# EAGLE design interceptor (EAGLE 9.6.2)
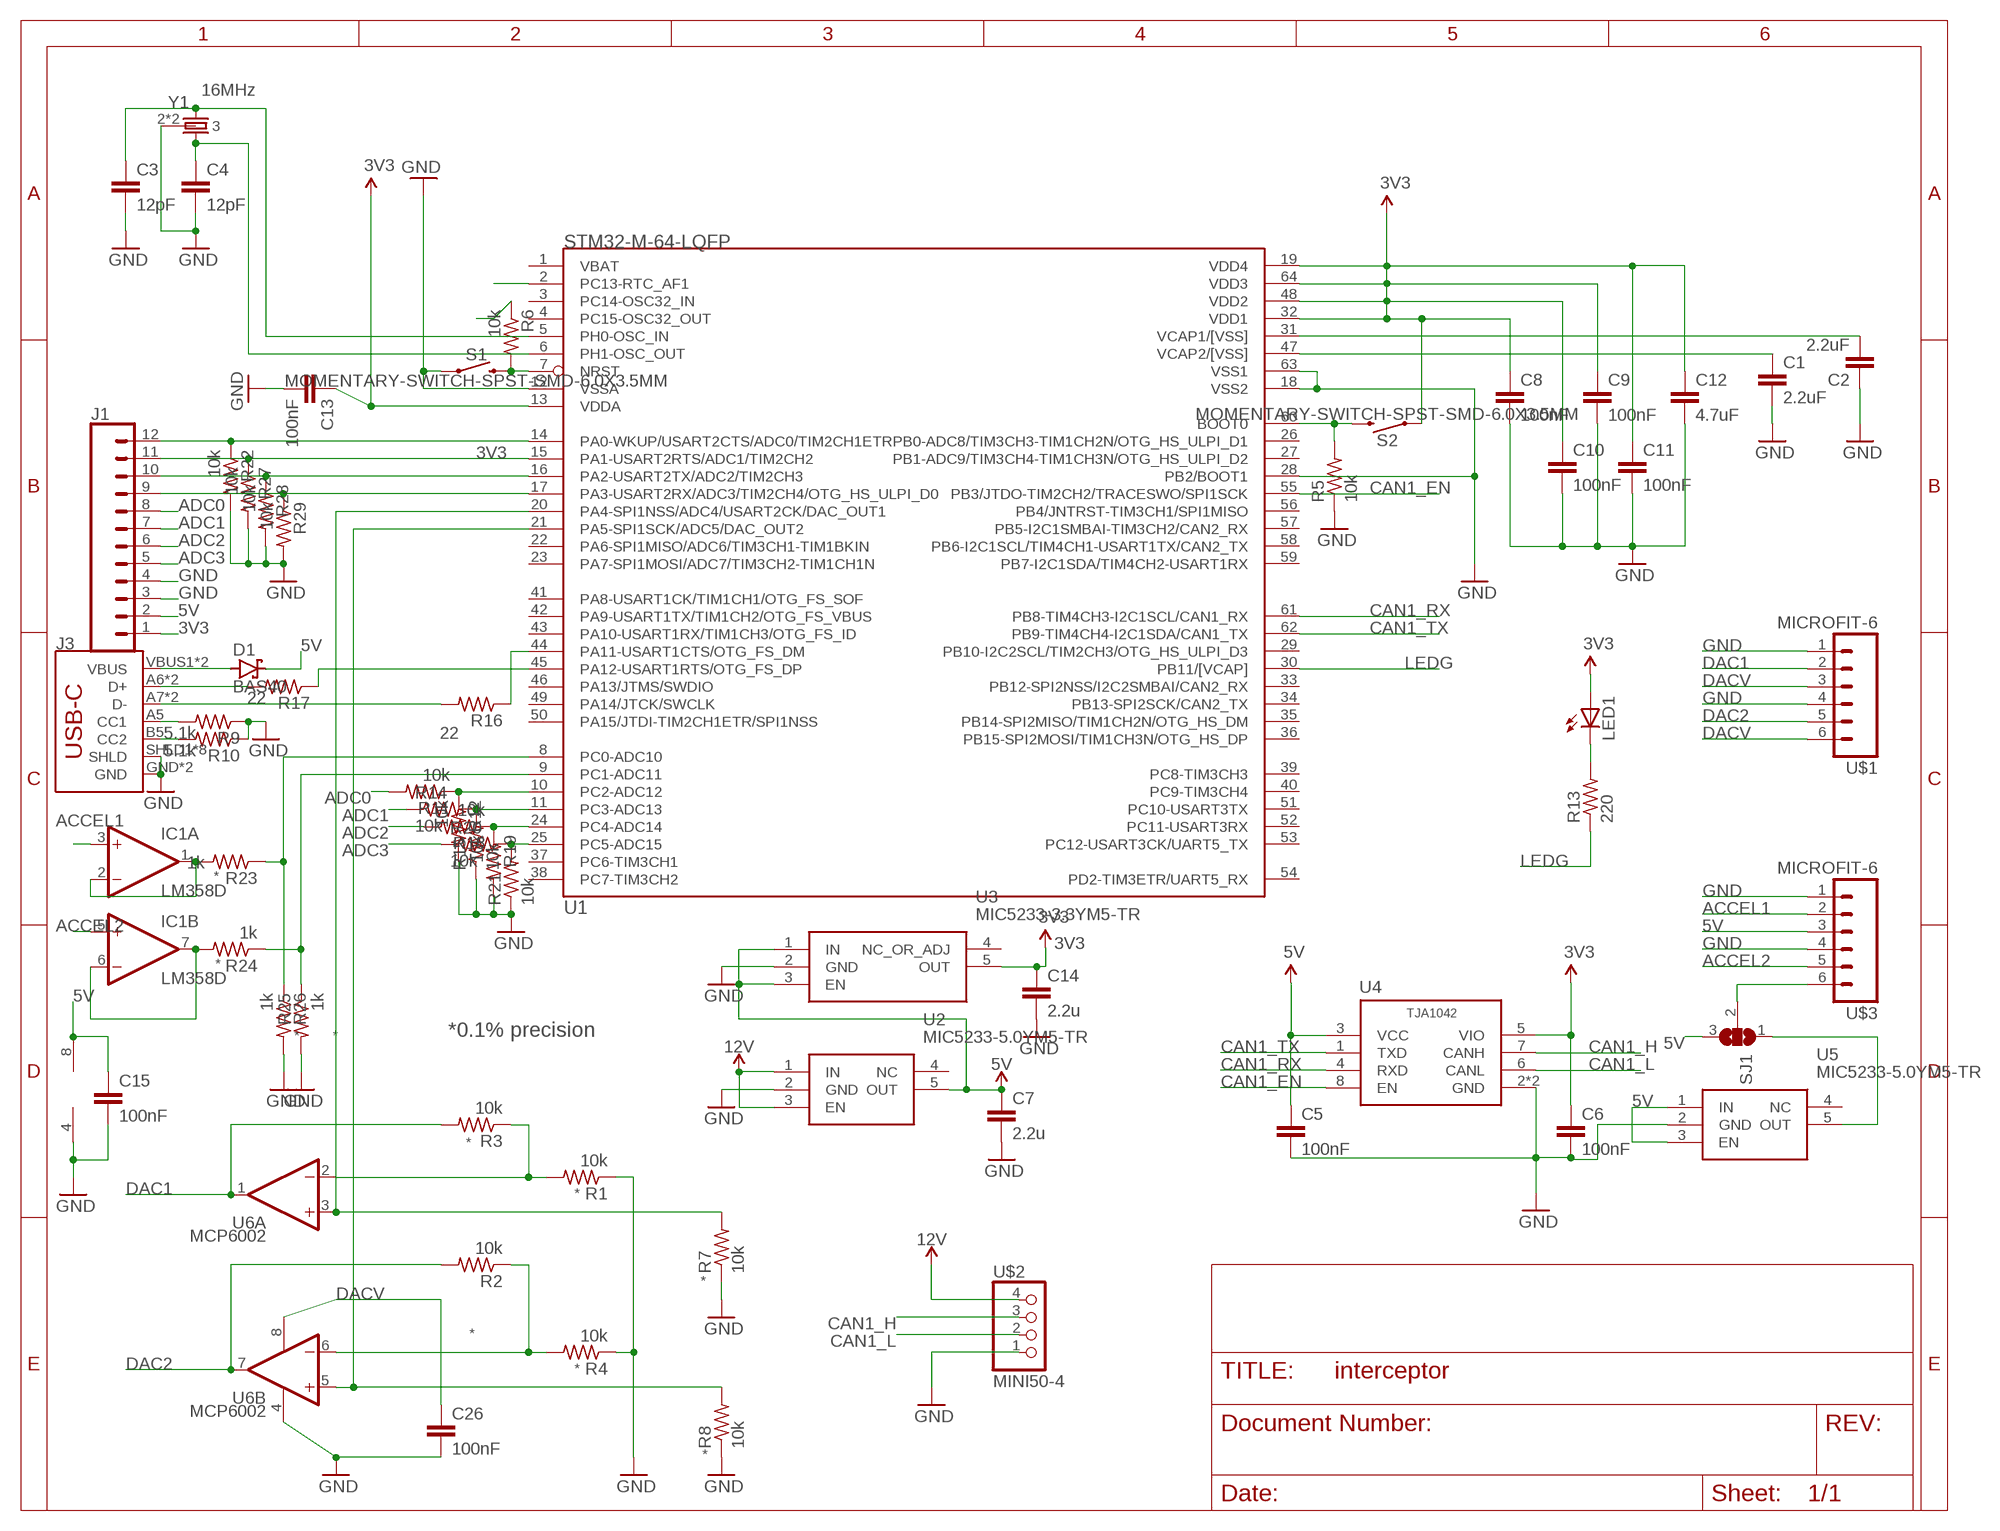
[diagram p0: schematic, sheet 1]

## Parts
C1  2.2uF  C0603  [0603-C]
C2  2.2uF  C0603  [0603-C]
C3  12pF  C0603  [0603-C]
C4  12pF  C0603  [0603-C]
C5  100nF  C0603  [0603-C]
C6  100nF  C0603  [0603-C]
C7  2.2u  C-EUC0603  [C0603]
C8  100nF  C0603  [0603-C]
C9  100nF  C0603  [0603-C]
C10  100nF  C0603  [0603-C]
C11  100nF  C0603  [0603-C]
C12  4.7uF  C0603  [0603-C]
C13  100nF  C0603  [0603-C]
C14  2.2u  C-EUC0603  [C0603]
C15  100nF  C0603  [0603-C]
C26  100nF  C0603  [0603-C]
D1  BAS40  [SOT23]
IC1  LM358D  [SO08]
J1  CONN_12  [1X12]
J3  USB-C-BREAKOUT_SPARKFUN-CONNECTORS_USB_C16PIN  [USB-C-BREAKOUT_SPARKFUN-CONNECTORS_USB-C-16P]
LED1  LEDCHIPLED_0805  [CHIPLED_0805]
R1  10k  R0402  [0402-R]
R2  10k  R0402  [0402-R]
R3  10k  R0402  [0402-R]
R4  10k  R0402  [0402-R]
R5  10k  R0402  [0402-R]
R6  10k  R0402  [0402-R]
R7  10k  R0402  [0402-R]
R8  10k  R0402  [0402-R]
R9  5.1k  R0402  [0402-R]
R10  5.1k  R0402  [0402-R]
R11  10k  R0402  [0402-R]
R12  10k  R0402  [0402-R]
R13  220  R0402  [0402-R]
R14  10k  R0402  [0402-R]
R15  10k  R0402  [0402-R]
R16  22  R0402  [0402-R]
R17  22  R0402  [0402-R]
R18  10k  R0402  [0402-R]
R19  10k  R0402  [0402-R]
R20  10k  R0402  [0402-R]
R21  10k  R0402  [0402-R]
R22  10k  R0402  [0402-R]
R23  1k  R0402  [0402-R]
R24  1k  R0402  [0402-R]
R25  1k  R0402  [0402-R]
R26  1k  R0402  [0402-R]
R27  10k  R0402  [0402-R]
R28  10k  R0402  [0402-R]
R29  10k  R0402  [0402-R]
S1  MOMENTARY-SWITCH-SPST-SMD-6.0X3.5MM  [TACTILE_SWITCH_SMD_6.0X3.5MM]
S2  MOMENTARY-SWITCH-SPST-SMD-6.0X3.5MM  [TACTILE_SWITCH_SMD_6.0X3.5MM]
SJ1  SJ2W  [SJ_2]
U1  STM32-M-64-LQFP  [LQFP64]
U2  MIC5233-5.0YM5-TR  [SOT95P280X145-5N]
U3  MIC5233-3.3YM5-TR  [SOT95P280X145-5N]
U4  TJA1042HVSON  [HVSON8]
U5  MIC5233-5.0YM5-TR  [SOT95P280X145-5N]
U6  MCP6002  LM358D  [SO08]
U$1  MICROFIT-6  [MICROFIT-6]
U$2  MINI50-4  [MINI50]
U$3  MICROFIT-6  [MICROFIT-6]
Y1  16MHz  CRYSTAL-3.2X2.54-PIN  [XTAL-3.2X2.5]

## Nets
3V3: C6.1 C8.1 C9.1 C10.1 C11.1 C12.1 C13.1 C14.1 J1.1 LED1.A R6.1 S2.1 U1.13(VDDA) U1.19(VDD4) U1.32(VDD1) U1.48(VDD2) U1.64(VDD3) U3.5(OUT) U4.5(VIO)
5V: C5.1 C7.1 C15.1 D1.3(C) IC1.8(P:V+) J1.2 SJ1.3 U2.5(OUT) U3.1(IN) U3.3(EN) U4.3(VCC) U5.1(IN) U5.3(EN) U$3.3
12V: U2.1(IN) U2.3(EN) U$2.4
ACCEL1: IC1.3(A:+IN) U$3.2
ACCEL2: IC1.5(B:+IN) U$3.5
ADC0: J1.8 R11.2
ADC1: J1.7 R14.1
ADC2: J1.6 R18.2
ADC3: J1.5 R20.1
CAN1_EN: U1.55(PB3/JTDO-TIM2CH2/TRACESWO/SPI1SCK) U4.8(EN)
CAN1_H: U4.7(CANH) U$2.3
CAN1_L: U4.6(CANL) U$2.2
CAN1_RX: U1.61(PB8-TIM4CH3-I2C1SCL/CAN1_RX) U4.4(RXD)
CAN1_TX: U1.62(PB9-TIM4CH4-I2C1SDA/CAN1_TX) U4.1(TXD)
DAC1: R3.2 U6.1(A:OUT) U$1.2
DAC2: R2.2 U6.7(B:OUT) U$1.5
DACV: C26.1 U6.8(P:V+) U$1.3 U$1.6
GND: C1.2 C2.1 C3.2 C4.2 C5.2 C6.2 C7.2 C8.2 C9.2 C10.2 C11.2 C12.2 C13.2 C14.2 C15.2 C26.2 IC1.4(P:V-) J1.3 J1.4 J3.GND J3.GND2(GND) J3.SHLD1(SHLD) J3.SHLD2(SHLD) J3.SHLD3(SHLD) J3.SHLD4(SHLD) J3.SHLD5(SHLD) J3.SHLD6(SHLD) J3.SHLD7(SHLD) J3.SHLD8(SHLD) R1.1 R4.1 R5.1 R7.1 R8.1 R9.1 R10.1 R12.2 R15.1 R19.2 R21.1 R22.2 R25.2 R26.2 R27.2 R28.2 R29.2 S1.1 U1.12(VSSA) U1.18(VSS2) U1.28(PB2/BOOT1) U1.63(VSS1) U2.2(GND) U3.2(GND) U4.2(GND) U4.PAD(GND) U5.2(GND) U6.4(P:V-) U$1.1 U$1.4 U$2.1 U$3.1 U$3.4 Y1.2 Y1.4
LEDG: R13.1 U1.30(PB11/[VCAP])
N$1: C3.1 U1.5(PH0-OSC_IN) Y1.1
N$2: R16.1 U1.44(PA11-USART1CTS/OTG_FS_DM)
N$3: C4.1 U1.6(PH1-OSC_OUT) Y1.3
N$4: R17.1 U1.45(PA12-USART1RTS/OTG_FS_DP)
N$5: J3.A7(D-) J3.B7(D-) R16.2
N$6: J3.A6(D+) J3.B6(D+) R17.2
N$7: R5.2 S2.2 U1.60(BOOT0)
N$8: J3.A5(CC1) R9.2
N$9: J3.B5(CC2) R10.2
N$10: R6.2 S1.2 U1.7(NRST)
N$11: D1.1(A) J3.VBUS1(VBUS) J3.VBUS2(VBUS)
N$12: SJ1.2 U$3.6
N$13: IC1.1(A:OUT) IC1.2(A:-IN) R23.2
N$14: SJ1.1 U5.5(OUT)
N$15: IC1.6(B:-IN) IC1.7(B:OUT) R24.2
N$16: R11.1 R12.1 U1.10(PC2-ADC12)
N$17: R7.2 U1.20(PA4-SPI1NSS/ADC4/USART2CK/DAC_OUT1) U6.3(A:+IN)
N$18: R8.2 U1.21(PA5-SPI1SCK/ADC5/DAC_OUT2) U6.5(B:+IN)
N$19: R14.2 R15.2 U1.11(PC3-ADC13)
N$20: R18.1 R19.1 U1.24(PC4-ADC14)
N$21: R1.2 R3.1 U6.2(A:-IN)
N$22: R2.1 R4.2 U6.6(B:-IN)
N$23: R20.2 R21.2 U1.25(PC5-ADC15)
N$24: U1.2(PC13-RTC_AF1)
N$26: LED1.C R13.2
N$29: J1.9 R29.1 U1.17(PA3-USART2RX/ADC3/TIM2CH4/OTG_HS_ULPI_D0)
N$30: J1.10 R28.1 U1.16(PA2-USART2TX/ADC2/TIM2CH3)
N$31: J1.11 R27.1 U1.15(PA1-USART2RTS/ADC1/TIM2CH2)
N$32: J1.12 R22.1 U1.14(PA0-WKUP/USART2CTS/ADC0/TIM2CH1ETR)
N$41: R23.1 R26.1 U1.8(PC0-ADC10)
N$42: R24.1 R25.1 U1.9(PC1-ADC11)
VCAP1: C2.2 U1.31(VCAP1/[VSS])
VCAP2: C1.1 U1.47(VCAP2/[VSS])
Unconnected: U1.1(VBAT) U1.3(PC14-OSC32_IN) U1.4(PC15-OSC32_OUT) U1.22(PA6-SPI1MISO/ADC6/TIM3CH1-TIM1BKIN) U1.23(PA7-SPI1MOSI/ADC7/TIM3CH2-TIM1CH1N) U1.26(PB0-ADC8/TIM3CH3-TIM1CH2N/OTG_HS_ULPI_D1) U1.27(PB1-ADC9/TIM3CH4-TIM1CH3N/OTG_HS_ULPI_D2) U1.29(PB10-I2C2SCL/TIM2CH3/OTG_HS_ULPI_D3) U1.33(PB12-SPI2NSS/I2C2SMBAI/CAN2_RX) U1.34(PB13-SPI2SCK/CAN2_TX) U1.35(PB14-SPI2MISO/TIM1CH2N/OTG_HS_DM) U1.36(PB15-SPI2MOSI/TIM1CH3N/OTG_HS_DP) U1.37(PC6-TIM3CH1) U1.38(PC7-TIM3CH2) U1.39(PC8-TIM3CH3) U1.40(PC9-TIM3CH4) U1.41(PA8-USART1CK/TIM1CH1/OTG_FS_SOF) U1.42(PA9-USART1TX/TIM1CH2/OTG_FS_VBUS) U1.43(PA10-USART1RX/TIM1CH3/OTG_FS_ID) U1.46(PA13/JTMS/SWDIO) U1.49(PA14/JTCK/SWCLK) U1.50(PA15/JTDI-TIM2CH1ETR/SPI1NSS) U1.51(PC10-USART3TX) U1.52(PC11-USART3RX) U1.53(PC12-USART3CK/UART5_TX) U1.54(PD2-TIM3ETR/UART5_RX) U1.56(PB4/JNTRST-TIM3CH1/SPI1MISO) U1.57(PB5-I2C1SMBAI-TIM3CH2/CAN2_RX) U1.58(PB6-I2C1SCL/TIM4CH1-USART1TX/CAN2_TX) U1.59(PB7-I2C1SDA/TIM4CH2-USART1RX) U2.4(NC) U3.4(NC_OR_ADJ) U5.4(NC)

## Notes on the sheet
- *
- *
- * | * | *0.1% precision
- *
- *
- *
- *
- *
- *

## Library data of the parts
C1-C6 C8-C13 C15 C26 = comma.ai:C
C7 C14 = rcl:C-EU: CAPACITOR, European symbol; SPICEPREFIX: C
D1 = diode:BAS40: Silicon Schottky Diodes General-purpose diode for high-speed switching
IC1 U6 = comma.ai:LM358: OP AMP also LM158; LM258; LM2904 Source: http://cache.national.com/ds/LM/LM158.pdf
J1 = SparkFun-Connectors:CONN_12: Multi connection point. Often used as Generic Header-pin footprint for 0.1 inch spaced/style header connections On any of the 0.1 inch spaced packages, you can populate with these: Break Away Headers - Straight <https://www.sparkfun.com/products/116> (PRT-00116) Break Away Male Headers - Right Angle <https://www.sparkfun.com/products/553> (PRT-00553) Female Headers <https://www.sparkfun.com/products/115> (PRT-00115) Break Away Headers - Machine Pin <https://www.sparkfun.com/products/117> (PRT-00117) Break Away Female Headers - Swiss Machine Pin <https://www.sparkfun.com/products/743> (PRT-00743) For SCREWTERMINALS and SPRING TERMINALS visit here: Screw Terimnals on SparkFun.com <https://www.sparkfun.com/search/results?term=Screw+Terminals> (5mm/3.5mm/2.54mm spacing) This device is also useful as a general connection point to wire up your design to another part of your project. Our various solder wires solder well into these plated through hole pads. Hook-Up Wire - Assortment (Stranded, 22 AWG) <https://www.sparkfun.com/products/11375> (PRT-11375) Hook-Up Wire - Assortment (Solid Core, 22 AWG) <https://www.sparkfun.com/products/11367> (PRT-11367) View the entire wire category on our website here <https://www.sparkfun.com/categories/141> Special notes: Molex polarized connector foot print use with SKU : PRT-08231 with associated crimp pins and housings. 1MM SMD Version SKU: PRT-10208 NOTES ON THE VARIANTS LOCK and LOCK_LONGPADS... This footprint was designed to help hold the alignment of a through-hole component (i.e. 6-pin header) while soldering it into place. You may notice that each hole has been shifted either up or down by 0.005 of an inch from it's more standard position (which is a perfectly straight line). This slight alteration caused the pins (the squares in the middle) to touch the edges of the holes. Because they are alternating, it causes a "brace" to hold the component in place. 0.005 has proven to be the perfect amount of "off-center" position when using our standard breakaway headers. Although looks a little odd when you look at the bare footprint, once you have a header in there, the alteration is very hard to notice. Also,if you push a header all the way into place, it is covered up entirely on the bottom side.
J3 = ROTR-Wireless:USB-C-BREAKOUT_SPARKFUN-CONNECTORS_USB_C: USB Type C 16Pin Connector Super Speed pins not available on the 16-pin purely SMD connector so this part is best for USB 2.0 implementations. D1 and D2 are tied together enabling D+/- no matter which way the cable is plugged into the connector. The two channel configuration pins (CC1/2) are exposed. These are normally connected to ground via 5.1k resistors but can be reconfigured for high current/high power applications.; PROD_ID: CONN-14122
LED1 = adafruit:LED: LED OSRAM: - CHIPLED LG R971, LG N971, LY N971, LG Q971, LY Q971, LO R971, LY R971 LH N974, LH R974 LS Q976, LO Q976, LY Q976 LO Q996 - Hyper CHIPLED LW Q18S LB Q993, LB Q99A, LB R99A - SideLED LS A670, LO A670, LY A670, LG A670, LP A670 LB A673, LV A673, LT A673, LW A673 LH A674 LY A675 LS A676, LA A676, LO A676, LY A676, LW A676 LS A679, LY A679, LG A679 - Hyper Micro SIDELED® LS Y876, LA Y876, LO Y876, LY Y876 LT Y87S - SmartLED LW L88C, LW L88S LB L89C, LB L89S, LG L890 LS L89K, LO L89K, LY L89K LS L896, LA L896, LO L896, LY L896 - TOPLED LS T670, LO T670, LY T670, LG T670, LP T670 LSG T670, LSP T670, LSY T670, LOP T670, LYG T670 LG T671, LOG T671, LSG T671 LB T673, LV T673, LT T673, LW T673 LH T674 LS T676, LA T676, LO T676, LY T676, LB T676, LH T676, LSB T676, LW T676 LB T67C, LV T67C, LT T67C, LS T67K, LO T67K, LY T67K, LW E67C LS E67B, LA E67B, LO E67B, LY E67B, LB E67C, LV E67C, LT E67C LW T67C LS T679, LY T679, LG T679 LS T770, LO T770, LY T770, LG T770, LP T770 LB T773, LV T773, LT T773, LW T773 LH T774 LS E675, LA E675, LY E675, LS T675 LS T776, LA T776, LO T776, LY T776, LB T776 LHGB T686 LT T68C, LB T68C - Hyper Mini TOPLED® LB M676 - Mini TOPLED Santana® LG M470 LS M47K, LO M47K, LY M47K Source: http://www.osram.convergy.de/
R1-R29 = comma.ai:R
S1 S2 = SparkFun-Switches:MOMENTARY-SWITCH-SPST: Momentary Switch (Pushbutton) - SPST Normally-open (NO) SPST momentary switches (buttons, pushbuttons). Variants PTH-12MM - 12mm square, through-hole Momentary Pushbutton Switch - 12mm Square <https://www.sparkfun.com/products/9190> (COM-09190) PTH-6.0MM, PTH-6.0MM-KIT - 6.0mm square, through-hole Mini Pushbutton Switch <https://www.sparkfun.com/products/97> (COM-00097) KIT package intended for soldering kit's - only one side of pads' copper is exposed. PTH-RIGHT-ANGLE-KIT - Right-angle, through-hole Right Angle Tactile Button <https://www.sparkfun.com/products/10791> - Used on SparkFun BigTime Watch Kit <https://www.sparkfun.com/products/11734> SMD-12MM - 12mm square, surface-mount Tactile Button - SMD (12mm) <https://www.sparkfun.com/products/12993> (COM-12993) Used on SparkFun PicoBoard <https://www.sparkfun.com/products/11888> SMD-4.5MM - 4.5mm Square Trackball Switch Used on SparkFun Blackberry Trackballer Breakout <https://www.sparkfun.com/products/13169> SMD-4.6MMX2.8MM - 4.60mm x 2.80mm, surface mount Used on SparkFun SAMD21 Mini Breakout <https://www.sparkfun.com/products/13664> SMD-5.2MM, SMD-5.2-REDUNDANT - 5.2mm square, surface-mount Mini Pushbutton Switch - SMD <https://www.sparkfun.com/products/8720> (COM-08720) Used on Arduino Pro Mini <https://www.sparkfun.com/products/11114> REDUNDANT package connects both switch circuits together SMD-6.0X3.5MM - 6.0 x 3.5mm, surface mount Momentary Reset Switch SMD <https://www.sparkfun.com/products/8229> (COM-08229) SMD-6.2MM-TALL - 6.2mm square, surface mount Tactile Button - SMD (6mm) <https://www.sparkfun.com/products/12992> Used on SparkFun Digital Sandbox <https://www.sparkfun.com/products/12651> SMD-RIGHT-ANGLE - Right-angle, surface mount Used on SparkFun Block for Intel® Edison - Arduino <https://www.sparkfun.com/products/13036>; PROD_ID: SWCH-00815; SF_SKU: COM-08229
SJ1 = jumper:SJ2W: SMD solder JUMPER
U1 = comma.ai:STM32-M-64-LQFP: STM32F103 Medium Density 64pin LQFP
U2 U5 = SamacSys_Parts:MIC5233-5.0YM5-TR: MICROCHIP - MIC5233-5.0YM5-TR - LDO, REG, 36VIN, 0.1A, 5V, 2%, 5SOT23 Source: Datasheet <https://componentsearchengine.com/Datasheets/2/MIC5233-5.0YM5-TR.pdf>; DESCRIPTION: MICROCHIP - MIC5233-5.0YM5-TR - LDO, REG, 36VIN, 0.1A, 5V, 2%, 5SOT23; HEIGHT: 1.45mm; MANUFACTURER_NAME: Microchip; MANUFACTURER_PART_NUMBER: MIC5233-5.0YM5-TR; MOUSER_PART_NUMBER: 998-MIC5233-5.0YM5TR; MOUSER_PRICE-STOCK: https://www.mouser.co.uk/ProductDetail/Microchip-Technology-Micrel/MIC5233-50YM5-TR?qs=U6T8BxXiZAWSnpCHgrMajw%3D%3D
U3 = SamacSys_Parts:MIC5233-3.3YM5-TR: High Input Voltage Low IQ UCAP LDO Regulator Source: Datasheet <http://ww1.microchip.com/downloads/en/DeviceDoc/MIC5233-Data-Sheet-DS20006033D.pdf>; DESCRIPTION: High Input Voltage Low IQ UCAP LDO Regulator; HEIGHT: 1.45mm; MANUFACTURER_NAME: Microchip; MANUFACTURER_PART_NUMBER: MIC5233-3.3YM5-TR; MOUSER_PART_NUMBER: 998-MIC5233-3.3YM5TR; MOUSER_PRICE-STOCK: https://www.mouser.co.uk/ProductDetail/Microchip-Technology-Micrel/MIC5233-33YM5-TR?qs=U6T8BxXiZAWDhshLMgpaLQ%3D%3D
U4 = comma.ai:TJA1042
U$1 U$3 = interceptor:MICROFIT-6
U$2 = interceptor:MINI50-4
Y1 = comma.ai:CRYSTAL-3.2X2.5

## Board
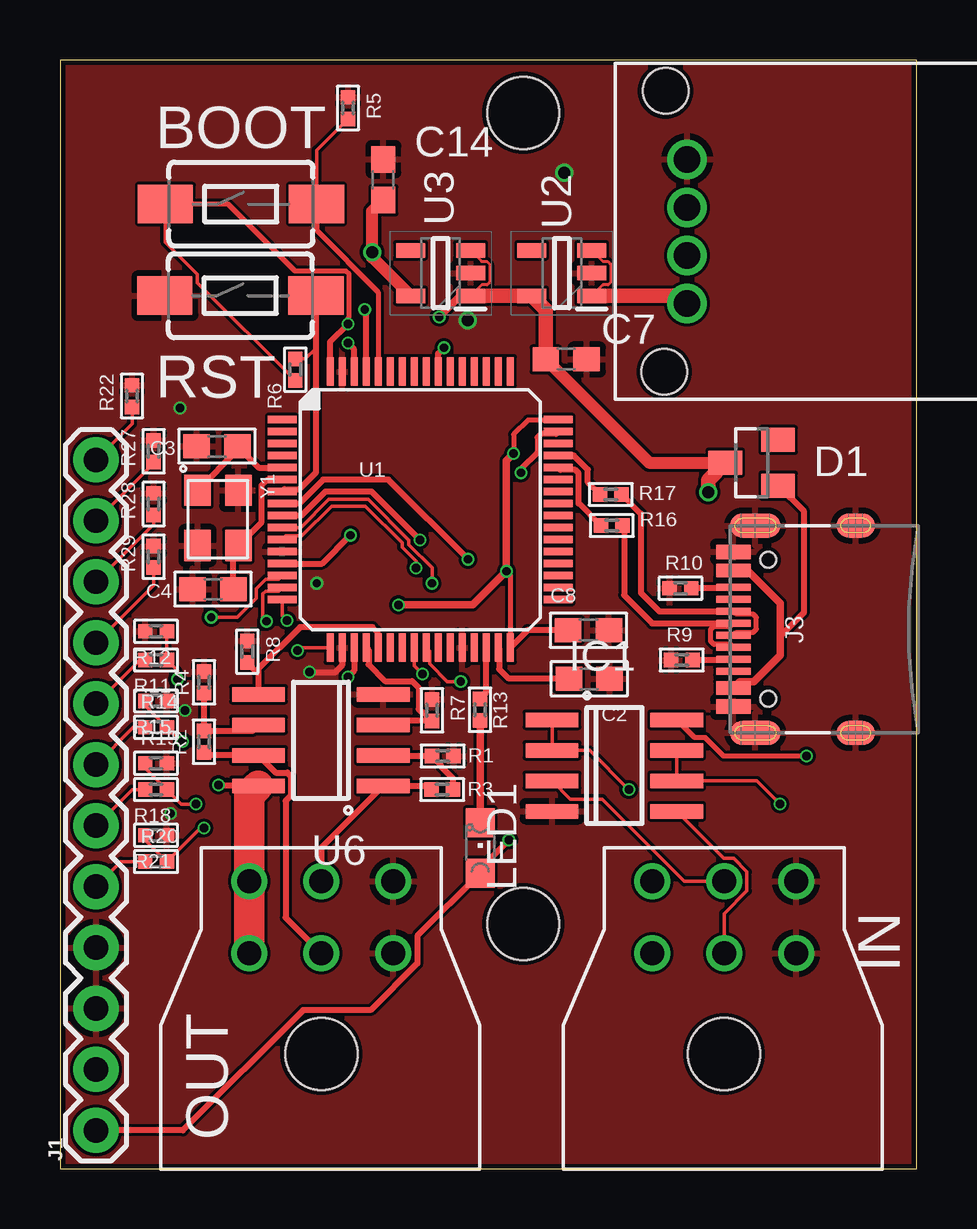
[diagram p1: board, top side]
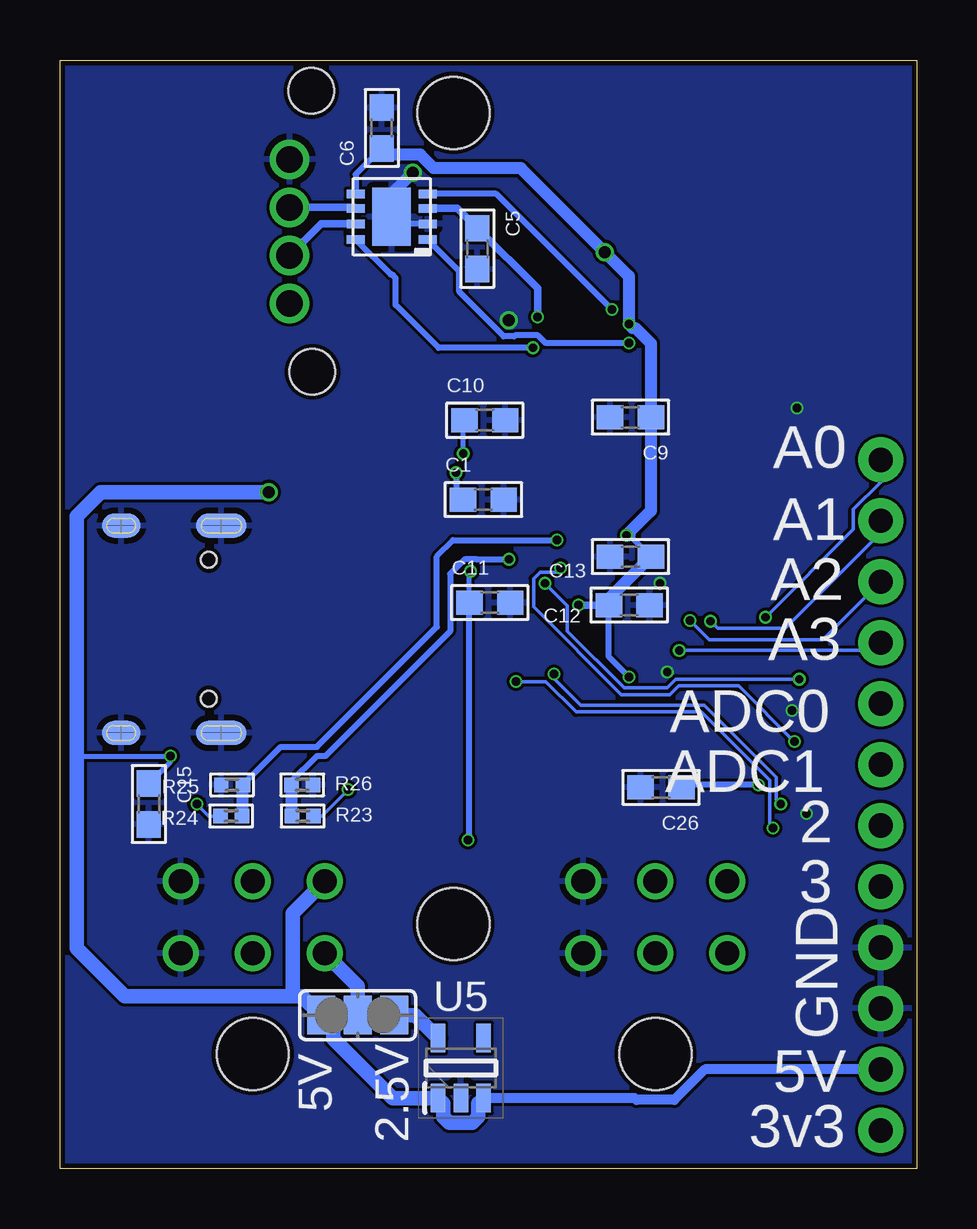
[diagram p2: board, bottom side, seen from below]

Size 35.7 x 46.2 mm. Coordinates in mm from the lower left corner, seen from the top.
Outline: 0,0 35.7,0 35.7,46.2 0,46.2 0,0
Copper layers (1*16): Top 0.035559375mm / dielectric 1.6mm / Bottom 0.035559375mm
Design rules "jlcpcb2layer": minimum track width 5mil, minimum drill 12mil, track to track 5mil, track to pad 5mil, pad to pad 5mil, via to via 5mil, smd to smd 5mil, copper to edge 8mil, drill to drill 6mil, minimum pad ring 5mil, minimum via ring 3mil, stop-mask expansion 2.5mil, vias tented up to drill 0mil, thermal gap 10mil
Holes 3 mm at 19.3,10.2 19.3,44

### Footprints (pad centres in the part's own frame; a part is rotated, then mirrored left to right if it is on the bottom)
0603-C = smd 1.1 x 1: 1 -0.85,0; 2 0.85,0
C0603 = smd 1.1 x 1: 1 -0.85,0; 2 0.85,0
SOT23 = smd 1 x 1.4: 1 -0.95,-1.1; 2 0.95,-1.1; 3 0,1.1
SO08 = smd 0.6 x 2.2: 1 -1.905,-2.6; 2 -0.635,-2.6; 3 0.635,-2.6; 4 1.905,-2.6; 5 1.905,2.6; 6 0.635,2.6; 7 -0.635,2.6; 8 -1.905,2.6
1X12 = drill 1.016 pad 1.88: 1 0,0; 2 2.54,0; 3 5.08,0; 4 7.62,0; 5 10.16,0; 6 12.7,0; 7 15.24,0; 8 17.78,0; 9 20.32,0; 10 22.86,0; 11 25.4,0; 12 27.94,0
USB-C-BREAKOUT_SPARKFUN-CONNECTORS_USB-C-16P = smd 0.3 x 1.45: A5 -1.25,0; A6 -0.25,0; A7 0.25,0; A8 1.25,0; B5 1.75,0; B6 0.75,0; B7 -0.75,0; B8 -1.75,0 | smd 0.6 x 1.45: GND -3.225,0; GND2 3.225,0 | smd 1 x 2.1: SHLD1 -4.32,-0.915; SHLD2 4.32,-0.915 | smd 1 x 2.1 bottom: SHLD3 -4.32,-0.915; SHLD4 4.32,-0.915 | smd 1 x 1.6: SHLD5 -4.32,-5.095; SHLD8 4.32,-5.095 | smd 1 x 1.6 bottom: SHLD6 -4.32,-5.095; SHLD7 4.32,-5.095 | smd 0.55 x 1.45: VBUS1 -2.45,0; VBUS2 2.45,0 | hole 0.65: -2.89,-1.445; 2.89,-1.445
CHIPLED_0805 = smd 1.2 x 1.2: A 0,-1.05; C 0,1.05
0402-R = smd 0.6 x 0.6: 1 -0.45,0; 2 0.45,0
TACTILE_SWITCH_SMD_6.0X3.5MM = smd 2.3 x 1.6: 1 -3.15,0; 2 3.15,0
SJ_2 = smd 1.168 x 1.6: 1 -1.524,0; 2 0,0; 3 1.524,0
LQFP64 = smd 1.2 x 0.3: 1 -5.75,3.75; 2 -5.75,3.25; 3 -5.75,2.75; 4 -5.75,2.25; 5 -5.75,1.75; 6 -5.75,1.25; 7 -5.75,0.75; 8 -5.75,0.25; 9 -5.75,-0.25; 10 -5.75,-0.75; 11 -5.75,-1.25; 12 -5.75,-1.75; 13 -5.75,-2.25; 14 -5.75,-2.75; 15 -5.75,-3.25; 16 -5.75,-3.75; 33 5.75,-3.75; 34 5.75,-3.25; 35 5.75,-2.75; 36 5.75,-2.25; 37 5.75,-1.75; 38 5.75,-1.25; 39 5.75,-0.75; 40 5.75,-0.25; 41 5.75,0.25; 42 5.75,0.75; 43 5.75,1.25; 44 5.75,1.75; 45 5.75,2.25; 46 5.75,2.75; 47 5.75,3.25; 48 5.75,3.75 | smd 0.3 x 1.2: 17 -3.75,-5.75; 18 -3.25,-5.75; 19 -2.75,-5.75; 20 -2.25,-5.75; 21 -1.75,-5.75; 22 -1.25,-5.75; 23 -0.75,-5.75; 24 -0.25,-5.75; 25 0.25,-5.75; 26 0.75,-5.75; 27 1.25,-5.75; 28 1.75,-5.75; 29 2.25,-5.75; 30 2.75,-5.75; 31 3.25,-5.75; 32 3.75,-5.75; 49 3.75,5.75; 50 3.25,5.75; 51 2.75,5.75; 52 2.25,5.75; 53 1.75,5.75; 54 1.25,5.75; 55 0.75,5.75; 56 0.25,5.75; 57 -0.25,5.75; 58 -0.75,5.75; 59 -1.25,5.75; 60 -1.75,5.75; 61 -2.25,5.75; 62 -2.75,5.75; 63 -3.25,5.75; 64 -3.75,5.75
SOT95P280X145-5N = smd 1.2 x 0.6: 1 -1.25,0.95; 2 -1.25,0; 3 -1.25,-0.95; 4 1.25,-0.95; 5 1.25,0.95
HVSON8 = smd 0.75 x 0.35: 1 -1.5,0.95; 2 -1.5,0.3; 3 -1.5,-0.35; 4 -1.5,-0.95; 5 1.5,-0.95; 6 1.5,-0.35; 7 1.5,0.3; 8 1.5,0.95 | smd 1.6 x 2.4: PAD 0,0
MICROFIT-6 = drill 1: 1 3,0; 2 0,0; 3 -3,0; 4 3,-3; 5 0,-3; 6 -3,-3 | hole 3: 0,-7.2
MINI50 = drill 1.1: 1 0,0; 2 2,0; 3 4,0; 4 6,0 | hole 1.9: -2.85,-0.9; 8.85,-0.95
XTAL-3.2X2.5 = smd 1.3 x 1.1: 1 0,-1.8; 2 2.3,-1.8; 3 2.3,-0.1; 4 0,-0.1

### Placement (x,y rotation side)
C1  18.06,27.88 0 bottom
C2  22.05,20.42 180 top
C3  6.54,30.11 180 top
C4  6.38,24.15 180 top
C5  18.31,38.34 270 bottom
C6  22.29,43.37 90 bottom
C7  21.09,33.73 0 top
C8  22.02,22.44 0 top
C9  11.93,31.32 180 bottom
C10  18,31.19 0 bottom
C11  17.79,23.59 0 bottom
C12  11.98,23.49 0 bottom
C13  11.93,25.51 180 bottom
C14  13.47,41.21 90 top
C15  32,15.2 270 bottom
C26  10.66,15.89 180 bottom
D1  28.82,29.42 90 top
IC1  23.1,16.8 270 top
J1  1.5,1.6 90 top
J3  28.06,22.48 90 top
LED1  17.51,13.37 0 top
R1  15.95,17.2 180 top
R2  6,17.79 270 top
R3  15.93,15.8 180 top
R4  6,20.27 270 top
R5  12,44.2 270 top
R6  9.8,33.3 90 top
R7  15.5,19.11 270 top
R8  7.8,21.55 270 top
R9  25.91,21.2 0 top
R10  25.85,24.19 0 top
R11  4,21.2 180 top
R12  4,22.4 180 top
R13  17.5,19.13 270 top
R14  4,18.4 0 top
R15  4,19.5 180 top
R16  22.99,26.8 0 top
R17  22.95,28.1 0 top
R18  4,15.8 180 top
R19  4,16.9 0 top
R20  4,12.8 0 top
R21  4,13.9 180 top
R22  3,32.2 90 top
R23  25.59,14.7 0 bottom
R24  28.57,14.7 180 bottom
R25  28.53,16 180 bottom
R26  25.61,16 0 bottom
R27  3.9,29.9 90 top
R28  3.9,27.7 90 top
R29  3.9,25.5 90 top
S1  7.52,36.38 0 top
S2  7.54,40.2 0 top
SJ1  23.3,6.4 180 bottom
U1  15.01,27.47 0 top
U2  20.91,37.32 180 top
U3  15.86,37.32 180 top
U4  21.88,39.67 180 bottom
U5  19,4.2 90 bottom
U6  10.87,17.86 90 top
U$1  10.89,11.98 0 top
U$2  26.13,42.06 270 top
U$3  27.67,11.98 0 top
Y1  7.53,28.27 270 top

### Tracks (layer width: path | path; a pad name or v marks a point on that pad's centre or on a via)
3V3  (via drill 0.35, 0.5)
  Top 0.152: R6.1 5.72,36.93 5.72,37.26 4.39,38.6 S2.1
  Top 0.2: v18.6,24.9 18.76,24.74 U1.32 | U1.48 20.74,31.2 19.5,31.2 18.9,30.6 v18.9,29.8 | S2.1 7,40.2 9.79,37.41 11.91,37.41 12.05,37.27 12.05,35.49 12,35.44 v12,35.2
  Top 0.254: C8.1 19.48,22.44 U1.32 | U1.19 12.26,20.76 v12,20.5 | U1.13 10.92,25.22 v12.1,26.4 | U1.64 11.26,34.46 v12,35.2 | v18.7,13.7 17.51,12.51 LED1.A 14.89,9.7 14.89,8.56 12.94,6.61 10.13,6.61 5.12,1.6 J1.1
  Top 0.305: v14.1,23.5 17.2,23.5 v18.6,24.9 18.6,29.5 v18.9,29.8
  Top 0.508: U3.5 13,37.98 v13,38.2 13,39.89 C14.1
  Bottom 0.2: C11.1 18.64,24.86 v18.6,24.9 | v18.9,29.8 18.9,31.14 C10.1
  Bottom 0.254: v12,20.5 12.83,21.33 C12.1 | 11.97,26.4 C13.1 | C6.1 23.38,41.43 U4.5 | v18.7,13.7 18.64,13.76 C11.1
  Bottom 0.305: C12.1 v14.09,23.49 v14.1,23.5
  Bottom 0.508: 11.97,26.4 v12.1,26.4 11.08,27.42 C9.1 11.08,34.39 11.73,35.04 11.84,35.04 v12,35.2 12,37.2 v13,38.2 16.5,41.7 20.13,41.7 20.69,42.26 22.03,42.26 C6.1 | C13.1 12.83,23.76 C12.1
5V  (via drill 0.35, 0.5)
  Top 0.127: U3.3 17.57,37.81 17.79,37.81 17.9,37.7 17.9,36.94 17.79,36.83 17.57,36.83 U3.1
  Top 0.2: IC1.8 26.44,17.96 26.89,17.96 27.66,17.2 v31.1,17.2
  Top 0.305: U3.1 16.67,36.37 v15.8,35.5
  Top 0.508: C7.1 24.55,29.42 D1.3
  Top 0.61: U3.1 U2.5 20.24,35.79 C7.1 | D1.3 27,28.7 v27,28.2
  Bottom 0.2: 35,17.2 v31.1,17.2 31.1,16.95 C15.1
  Bottom 0.305: v15.8,35.5 15.8,36.68 C5.1 19.14,40.02 U4.3
  Bottom 0.406: J1.2 8.83,4.14 10.1,2.87 11.68,2.87 11.76,2.95 U5.3
  Bottom 0.61: v27,28.2 34,28.2 35,27.2 35,17.2 35,9.2 33,7.2 26,7.2 | 26,7.2 25.62,7.2 SJ1.3 24.32,5.89 24.32,5.42 21.84,2.95 U5.1 19.73,2.73 19.73,2.17 19.48,1.92 18.52,1.92 18.27,2.17 18.27,2.73 U5.3 | U$3.3 26,10.65 26,7.2
12V
  Top 0.127: U2.3 22.62,37.81 22.84,37.81 22.95,37.7 22.95,36.94 22.84,36.83 22.62,36.83 U2.1
  Top 0.61: U2.1 25.82,36.37 U$2.4
ACCEL1
  Top 0.152: IC1.3 21.27,15.4 22.6,15.4 26.02,11.98 U$3.2
ACCEL2
  Top 0.152: IC1.5 27.66,12.93 28.07,12.93 28.62,12.38 28.62,11.58 27.67,10.63 U$3.5
ADC0
  Top 0.152: J1.8 3.32,21.2 R11.2
ADC1
  Top 0.152: J1.7 3.06,18.4 R14.1
ADC2
  Top 0.152: J1.6 3,15.8 R18.2
ADC3
  Top 0.152: J1.5 2.54,12.8 R20.1
CAN1_EN  (via drill 0.35)
  Top 0.254: U1.55 15.76,33.97 v16,34.21
  Bottom 0.254: U4.8 21.92,37.26 21.86,37.26 21.72,37.12 21.72,36 19.93,34.21 v16,34.21
CAN1_H
  Bottom 0.305: U4.7 24.82,39.37 U$2.3
CAN1_L
  Bottom 0.305: U4.6 23.42,40.06 U$2.2
CAN1_RX  (via drill 0.35)
  Top 0.254: U1.61 12.76,35.74 v12.7,35.8
  Bottom 0.254: v12.7,35.8 17.52,40.62 U4.4
CAN1_TX  (via drill 0.35)
  Top 0.254: U1.62 12.26,34.14 v12,34.4
  Bottom 0.254: U4.1 19.06,37.4 19.06,36.53 17.21,34.68 16.79,34.68 16.74,34.73 15.79,34.73 15.46,34.4 v12,34.4
DAC1
  Top 0.254: U$1.2 10.89,13.38 U6.1 15.32,15.96 R3.2
DAC2
  Top 0.254: U$1.5 9.4,10.47 9.4,15.33 9.62,15.55 9.62,16.36 9.47,16.51 8.99,16.51 U6.7 6.12,17.22 R2.2
DACV  (via drill 0.35)
  Top 0.254: U6.8 6.64,15.96 v6.6,16
  Top 1.27: U$1.6 U$1.3 7.89,15.57 U6.8
  Bottom 0.254: v6.6,16 9.7,16 C26.1
GND  (via drill 0.35, 0.5)
  Top 0.254: U1.18 11.76,20.99 11.47,20.7 v10.4,20.7
  Bottom 0.254: U4.2 21.58,39.37 U4.PAD
  Bottom 0.508: U4.PAD 21.88,40.62 v21,41.5
  other vias: 17,35.36 10.7,24.4 4.6,14.8 5.2,19.1 5,31.7
  pour Top: 0,0.2 0,46.2 35.7,46.2 35.7,0.2
  pour Bottom: 0,0.2 0,46.2 35.7,46.2 35.7,0.2
LEDG
  Top 0.254: R13.1 17.76,19.84 U1.30
N$1
  Top 0.254: Y1.1 7.39,29.93 C3.1 8.28,29.22 U1.5
N$2
  Top 0.254: R16.1 21.61,27.73 21.61,28.97 21.46,29.12 20.86,29.12 U1.44
N$3
  Top 0.254: C4.1 7.23,25.97 Y1.3 8.41,26.95 8.41,28.47 8.63,28.7 9.24,28.7 U1.6
N$4
  Top 0.254: R17.1 22,28.61 22,29.13 21.41,29.72 U1.45
N$5
  Top 0.203: J3.B7 27.94,21.85 27.24,21.85 27.11,21.98 27.11,22.47 27.24,22.61 27.94,22.61 J3.A7
  Top 0.254: R16.2 23.5,26.74 23.5,23.9 24.67,22.73 J3.A7
N$6
  Top 0.203: J3.B6 28.18,23.11 28.88,23.11 29.01,22.97 29.01,22.48 28.88,22.35 28.18,22.35 J3.A6
  Top 0.254: R17.2 24.2,27.3 24.2,24 24.97,23.23 J3.B6
N$7
  Top 0.152: S2.2 10.69,42.44 R5.2
  Top 0.2: S2.2 10.69,39.1 13.26,36.53 U1.60
N$8
  Top 0.254: J3.A5 28.03,21.2 R9.2
N$9
  Top 0.254: J3.B5 28.02,24.19 R10.2
N$10
  Top 0.152: R6.2 10.22,33.75 10.67,34.2
  Top 0.254: U1.7 9.36,28.32 9.96,28.32 10.67,29.02 10.67,34.2 S1.2
N$11
  Top 0.254: 30,22.2 31,23.2 31,27.39 D1.1
  Top 0.305: J3.VBUS1 28.33,20.3 28.9,20.3 30,21.4 30,22.2 30,23.56 28.63,24.93 J3.VBUS2
N$12
  Bottom 0.61: SJ1.2 23.3,7.61 U$3.6
N$13  (via drill 0.35)
  Top 0.152: IC1.1 IC1.2 22.07,17.43 v23.7,15.8
  Bottom 0.152: v23.7,15.8 24.8,14.7 R23.2
N$14
  Bottom 0.61: U5.5 20.9,6.4 SJ1.1
N$15  (via drill 0.35)
  Top 0.152: v30,15.2 29.04,16.16 IC1.6 IC1.7
  Bottom 0.152: v30,15.2 29.5,14.7 R24.2
N$16  (via drill 0.35)
  Top 0.152: R12.1 R11.1 4.9,20.75 v4.9,20.4 | U1.10 10.03,26.72 11.2,27.89 12.84,27.89 14.53,26.2 14.53,26.01 15.5,25.04 v15.5,24.4
  Bottom 0.152: v15.5,24.4 14.57,23.47 14.57,22.41 12.19,20.03 10.41,20.03 10.04,20.4 v4.9,20.4
N$17
  Top 0.254: U6.3 13.63,18.66 R7.2 15.15,19.01 15.1,19.01 14.95,19.15 14.95,20.05 14.68,20.32 13.55,20.32 12.86,21.02 12.86,21.62 U1.20
N$18
  Top 0.254: R8.2 8.27,20.63 U6.5 8.27,20.84 10,22.57 13.02,22.57 13.24,22.35 13.24,21.74 U1.21
N$19  (via drill 0.35)
  Top 0.152: R15.2 3.55,19.3 R14.2 4.5,18.4 v5.1,17.8 | U1.11 9.41,26.37 10.07,26.37 11.31,27.61 12.73,27.61 14.26,26.08 14.26,25.89 14.84,25.3 v14.84,25.04
  Bottom 0.152: v14.84,25.04 15.02,24.87 15.69,24.87 15.97,24.59 15.97,23.41 12.31,19.75 10.29,19.75 9.93,20.12 7.42,20.12 v5.1,17.8
N$20  (via drill 0.35)
  Top 0.152: R19.1 3.55,16.7 R18.1 5.05,15.2 v5.67,15.2 | v15.11,20.61 14.76,20.96 U1.24
  Bottom 0.152: v5.67,15.2 5.86,15.39 5.86,16.31 8.37,18.83 8.86,19.31 14,19.31 15.11,20.43 v15.11,20.61
N$21
  Top 0.254: R3.1 16.38,16.26 15.85,16.79 15.85,16.85 R1.2 13.49,17.2 U6.2
N$22
  Top 0.254: U6.6 8.02,18.24 R2.1 R4.2
N$23  (via drill 0.35)
  Top 0.152: R21.2 3.55,13.7 R20.2 5.85,14.2 v6,14.2 | U1.25 15.41,21.57 15.41,21.04 16.14,20.3 v16.7,20.3
  Bottom 0.152: v16.7,20.3 15.46,20.3 14.19,19.03 8.98,19.03 6.13,16.19 6.13,14.33 v6,14.2
N$26
  Top 0.305: LED1.C 17.5,18.37 R13.2
N$29  (via drill 0.35)
  Top 0.152: J1.9 3.9,24.32 R29.1 | U1.17 10.02,21.72 v9.9,21.6
  Bottom 0.152: v9.9,21.6 1.82,21.6 J1.9
N$30  (via drill 0.35)
  Top 0.152: J1.10 3.9,26.86 R28.1 | U1.16 9.26,23.04 v9.45,22.85
  Bottom 0.152: v9.45,22.85 8.65,22.05 3.91,22.05 J1.10
N$31  (via drill 0.35)
  Top 0.152: J1.11 3.9,29.4 R27.1 | v8.6,22.82 8.46,22.96 8.46,23.95 8.58,24.07 9.11,24.07 U1.15
  Bottom 0.152: v8.6,22.82 8.3,22.52 5.48,22.52 1.5,26.5 J1.11
N$32  (via drill 0.35)
  Top 0.152: J1.12 3,31.04 R22.1 | U1.14 9.11,24.57 8.58,24.57 8.18,24.18 8.18,23.77 7.39,22.98 v6.3,22.98
  Bottom 0.152: v6.3,22.98 2.64,26.64 2.64,27.47 1.5,28.62 J1.12
N$41  (via drill 0.35)
  Top 0.254: v17,25.4 13.68,28.72 10.96,28.72 9.96,27.72 U1.8
  Bottom 0.254: v17,25.4 18.37,25.4 18.39,25.42 18.81,25.42 19.44,24.79 19.44,22.4 24.64,17.2 25,17.2 26.06,16.14 R26.1
  Bottom 0.508: R23.1 26.04,15.98 R26.1
N$42  (via drill 0.35)
  Top 0.254: v15,26.2 12.98,28.22 11.06,28.22 10.06,27.22 U1.9
  Bottom 0.254: v15,26.2 19.32,26.2 20,25.52 20,22.58 25,17.58 26.5,17.58 R25.1
  Bottom 0.508: R24.1 28.08,14.74 R25.1
VCAP1
  Top 0.254: U1.31 18.3,21.68 18.3,20.82 18.7,20.42 C2.2
VCAP2  (via drill 0.35)
  Top 0.254: v19.2,29 19.2,29.16 19.91,29.87 19.91,30.47 20.05,30.62 20.66,30.62 U1.47
  Bottom 0.254: v19.2,29 19.2,28.17 C1.1

### Text on the board
tNames: BOOT | RST | IN | OUT
bNames: A0 | A1 | A2 | A3 | ADC0 | ADC1 | 2 | 3 | GND | 2.5V | 5V | 5V | 3v3